# EAGLE design Trainii (EAGLE 9.1.1)
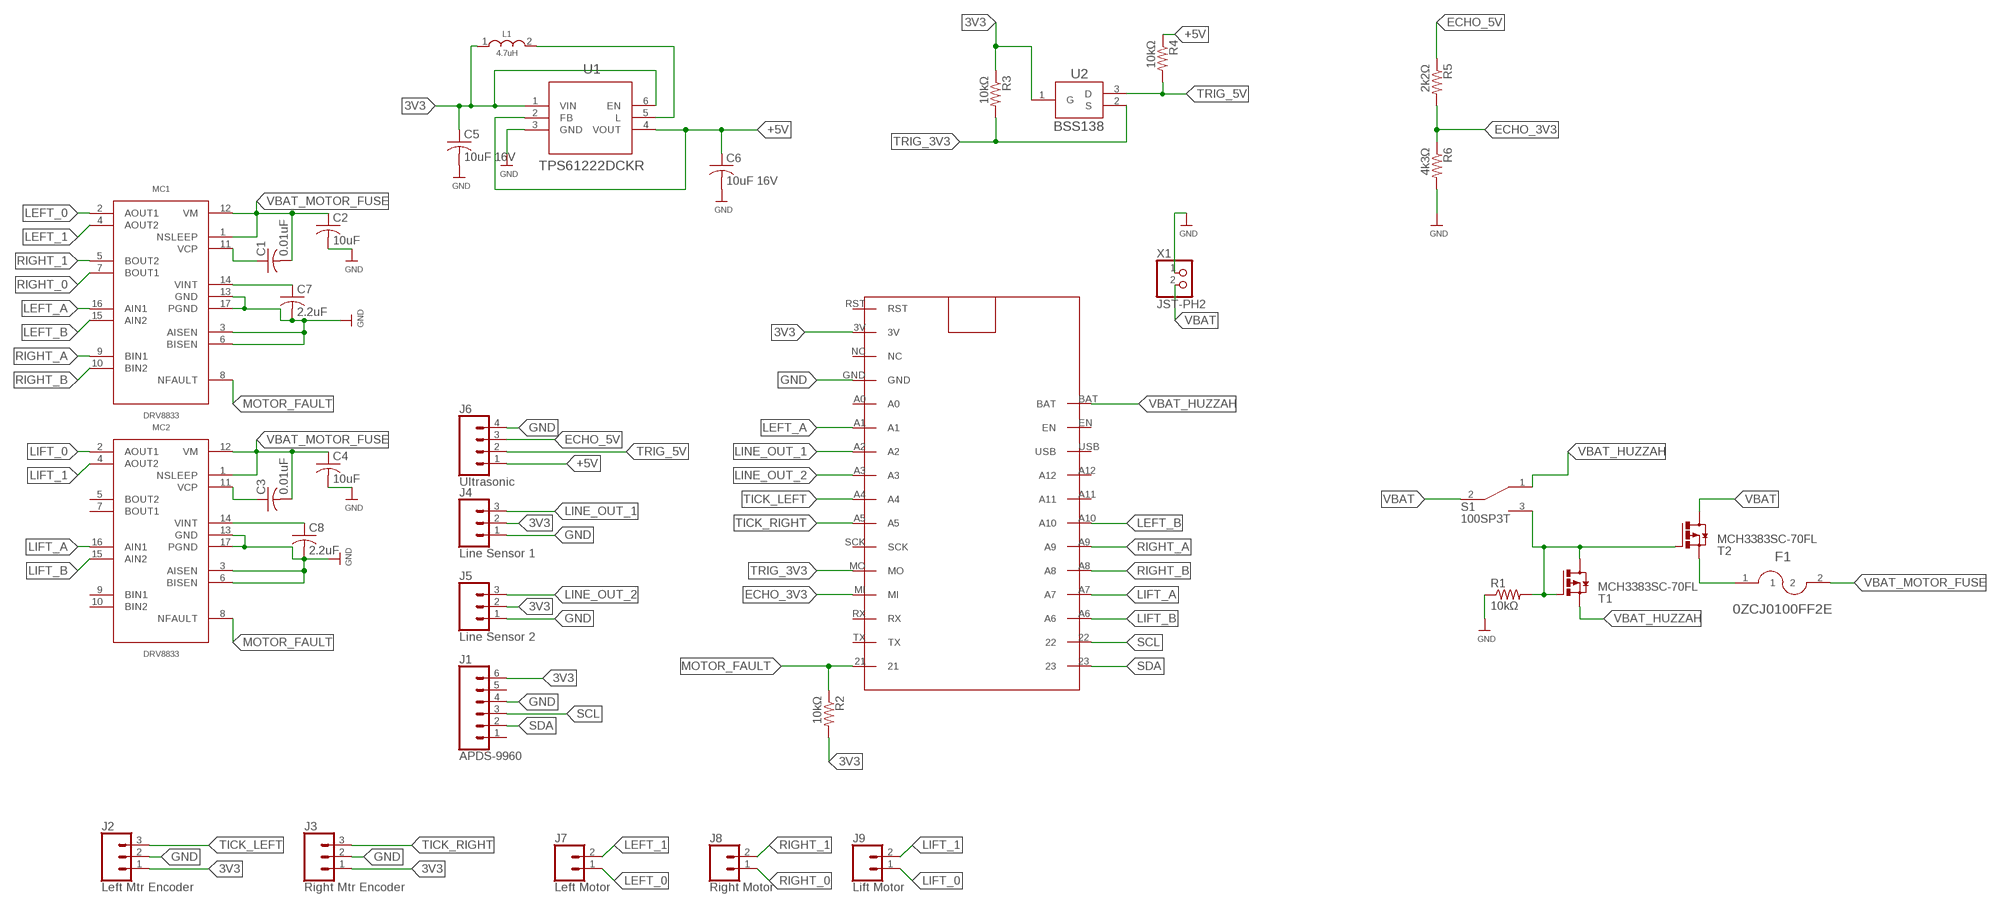
[diagram p0: schematic, sheet 1]

## Parts
C1  0.01uF  C-USC0805  [C0805]
C2  10uF  C-USC0805  [C0805]
C3  0.01uF  C-USC0805  [C0805]
C4  10uF  C-USC0805  [C0805]
C5  10uF 16V  C-USC0805  [C0805]
C6  10uF 16V  C-USC0805  [C0805]
C7  2.2uF  C-USC0805  [C0805]
C8  2.2uF  C-USC0805  [C0805]
F1  0ZCJ0100FF2E  [1206]
J1  APDS-9960  CONN_06SILK_FEMALE_PTH  [1X06]
J2  Left Mtr Encoder  CONN_03  [1X03]
J3  Right Mtr Encoder  CONN_03  [1X03]
J4  Line Sensor 1  CONN_03  [1X03]
J5  Line Sensor 2  CONN_03  [1X03]
J6  Ultrasonic  CONN_04  [1X04]
J7  Left Motor  CONN_02  [1X02]
J8  Right Motor  CONN_02  [1X02]
J9  Lift Motor  CONN_02  [1X02]
L1  4.7uH  VLS3012HBX  [VLS3012HBX]
M1  ESP32  [ESP32]
MC1  DRV8833  [HTSSOP-16]
MC2  DRV8833  [HTSSOP-16]
R1  10kΩ  R-US_R0805  [R0805]
R2  10kΩ  R-US_R0805  [R0805]
R3  10kΩ  R-US_R0805  [R0805]
R4  10kΩ  R-US_R0805  [R0805]
R5  2k2Ω  R-US_M0805  [M0805]
R6  4k3Ω  R-US_M0805  [M0805]
S1  100SP3T  [100SP3T]
T1  MCH3383SC-70FL  [SOTFL65P210X90-3]
T2  MCH3383SC-70FL  [SOTFL65P210X90-3]
U1  TPS61222DCKR  [DCK6]
U2  BSS138  [SOT-23-3L]
X1  JST-PH2  [JST-PH]

## Nets
3V3: C5.1 J1.6 J2.1 J3.1 J4.2 J5.2 L1.1(IN) M1.3V R2.2 R3.1 U1.1(VIN) U1.6(EN) U2.1(G)
+5V: C6.1 J6.1 R4.1 U1.2(FB) U1.4(VOUT)
ECHO_3V3: M1.MI R5.2 R6.1
ECHO_5V: J6.3 R5.1
GND: C2.2 C4.2 C5.2 C6.2 C7.2 C8.2 J1.4 J2.2 J3.2 J4.1 J5.1 J6.4 M1.GND MC1.3(AISEN) MC1.6(BISEN) MC1.13(GND) MC1.17(PGND) MC2.3(AISEN) MC2.6(BISEN) MC2.13(GND) MC2.17(PGND) R1.1 R6.2 U1.3(GND) X1.1
LEFT_0: J7.1 MC1.2(AOUT1)
LEFT_1: J7.2 MC1.4(AOUT2)
LEFT_A: M1.A1 MC1.16(AIN1)
LEFT_B: M1.A10 MC1.15(AIN2)
LIFT_0: J9.1 MC2.2(AOUT1)
LIFT_1: J9.2 MC2.4(AOUT2)
LIFT_A: M1.A7 MC2.16(AIN1)
LIFT_B: M1.A6 MC2.15(AIN2)
LINE_OUT_1: J4.3 M1.A2
LINE_OUT_2: J5.3 M1.A3
MOTOR_FAULT: M1.21 MC1.8(NFAULT) MC2.8(NFAULT) R2.1
N$1: L1.2(OUT) U1.5(L)
N$2: R1.2 S1.3(B) T1.1(G) T1.3(D) T2.1(G)
N$5: C8.1 MC2.14(VINT)
N$7: C1.1 MC1.11(VCP)
N$8: C7.1 MC1.14(VINT)
N$11: C3.1 MC2.11(VCP)
RIGHT_0: J8.1 MC1.7(BOUT1)
RIGHT_1: J8.2 MC1.5(BOUT2)
RIGHT_A: M1.A9 MC1.9(BIN1)
RIGHT_B: M1.A8 MC1.10(BIN2)
SCL: J1.3 M1.22
SDA: J1.2 M1.23
TICK_LEFT: J2.3 M1.A4
TICK_RIGHT: J3.3 M1.A5
TRIG_3V3: M1.MO R3.2 U2.2(S)
TRIG_5V: J6.2 R4.2 U2.3(D)
VBAT: S1.2(COMMON) T2.3(D) X1.2
VBAT_HUZZAH: M1.BAT S1.1(A) T1.2(S)
VBAT_MOTOR: F1.1 T2.2(S)
VBAT_MOTOR_FUSE: C1.2 C2.1 C3.2 C4.1 F1.2 MC1.1(NSLEEP) MC1.12(VM) MC2.1(NSLEEP) MC2.12(VM)
Unconnected: J1.1 J1.5 M1.A0 M1.A11 M1.A12 M1.EN M1.NC M1.RST M1.RX M1.SCK M1.TX M1.USB MC2.5(BOUT2) MC2.7(BOUT1) MC2.9(BIN1) MC2.10(BIN2)

## Library data of the parts
C1-C8 = rcl:C-US: CAPACITOR, American symbol; SPICEPREFIX: C
F1 = Trainii:0ZCJ0100FF2E
J1 = SparkFun-Connectors:CONN_06: Multi connection point. Often used as Generic Header-pin footprint for 0.1 inch spaced/style header connections On any of the 0.1 inch spaced packages, you can populate with these: Break Away Headers - Straight <https://www.sparkfun.com/products/116> (PRT-00116) Break Away Male Headers - Right Angle <https://www.sparkfun.com/products/553> (PRT-00553) Female Headers <https://www.sparkfun.com/products/115> (PRT-00115) Break Away Headers - Machine Pin <https://www.sparkfun.com/products/117> (PRT-00117) Break Away Female Headers - Swiss Machine Pin <https://www.sparkfun.com/products/743> (PRT-00743) Arduino Stackable Header - 6 Pin <https://www.sparkfun.com/products/9280> (PRT-09280) For SCREWTERMINALS and SPRING TERMINALS visit here: Screw Terimnals on SparkFun.com <https://www.sparkfun.com/search/results?term=Screw+Terminals> (5mm/3.5mm/2.54mm spacing) This device is also useful as a general connection point to wire up your design to another part of your project. Our various solder wires solder well into these plated through hole pads. Hook-Up Wire - Assortment (Stranded, 22 AWG) <https://www.sparkfun.com/products/11375> (PRT-11375) Hook-Up Wire - Assortment (Solid Core, 22 AWG) <https://www.sparkfun.com/products/11367> (PRT-11367) View the entire wire category on our website here <https://www.sparkfun.com/categories/141>; PROD_ID: CONN-08437
J2-J5 = SparkFun-Connectors:CONN_03: Multi connection point. Often used as Generic Header-pin footprint for 0.1 inch spaced/style header connections On any of the 0.1 inch spaced packages, you can populate with these: Break Away Headers - Straight <https://www.sparkfun.com/products/116> (PRT-00116) Break Away Male Headers - Right Angle <https://www.sparkfun.com/products/553> (PRT-00553) Female Headers <https://www.sparkfun.com/products/115> (PRT-00115) Break Away Headers - Machine Pin <https://www.sparkfun.com/products/117> (PRT-00117) Break Away Female Headers - Swiss Machine Pin <https://www.sparkfun.com/products/743> (PRT-00743) Stackable Header - 3 Pin (Female, 0.1") <https://www.sparkfun.com/products/13875> (PRT-13875) For SCREWTERMINALS and SPRING TERMINALS visit here: Screw Terimnals on SparkFun.com <https://www.sparkfun.com/search/results?term=Screw+Terminals> (5mm/3.5mm/2.54mm spacing) This device is also useful as a general connection point to wire up your design to another part of your project. Our various solder wires solder well into these plated through hole pads. Hook-Up Wire - Assortment (Stranded, 22 AWG) <https://www.sparkfun.com/products/11375> (PRT-11375) Hook-Up Wire - Assortment (Solid Core, 22 AWG) <https://www.sparkfun.com/products/11367> (PRT-11367) View the entire wire category on our website here <https://www.sparkfun.com/categories/141> Special notes: Molex polarized connector foot print use with SKU : PRT-08232 with associated crimp pins and housings.
J6 = SparkFun-Connectors:CONN_04: Multi connection point. Often used as Generic Header-pin footprint for 0.1 inch spaced/style header connections On any of the 0.1 inch spaced packages, you can populate with these: Break Away Headers - Straight <https://www.sparkfun.com/products/116> (PRT-00116) Break Away Male Headers - Right Angle <https://www.sparkfun.com/products/553> (PRT-00553) Female Headers <https://www.sparkfun.com/products/115> (PRT-00115) Break Away Headers - Machine Pin <https://www.sparkfun.com/products/117> (PRT-00117) Break Away Female Headers - Swiss Machine Pin <https://www.sparkfun.com/products/743> (PRT-00743) For SCREWTERMINALS and SPRING TERMINALS visit here: Screw Terimnals on SparkFun.com <https://www.sparkfun.com/search/results?term=Screw+Terminals> (5mm/3.5mm/2.54mm spacing) This device is also useful as a general connection point to wire up your design to another part of your project. Our various solder wires solder well into these plated through hole pads. Hook-Up Wire - Assortment (Stranded, 22 AWG) <https://www.sparkfun.com/products/11375> (PRT-11375) Hook-Up Wire - Assortment (Solid Core, 22 AWG) <https://www.sparkfun.com/products/11367> (PRT-11367) View the entire wire category on our website here <https://www.sparkfun.com/categories/141> Special notes: Molex polarized connector foot print use with SKU : PRT-08231 with associated crimp pins and housings. 1MM SMD Version SKU: PRT-10208; PROD_ID: CONN-09696
J7-J9 = SparkFun-Connectors:CONN_02: Multi connection point. Often used as Generic Header-pin footprint for 0.1 inch spaced/style header connections On any of the 0.1 inch spaced packages, you can populate with these: Break Away Headers - Straight <https://www.sparkfun.com/products/116> (PRT-00116) Break Away Male Headers - Right Angle <https://www.sparkfun.com/products/553> (PRT-00553) Female Headers <https://www.sparkfun.com/products/115> (PRT-00115) Break Away Headers - Machine Pin <https://www.sparkfun.com/products/117> (PRT-00117) Break Away Female Headers - Swiss Machine Pin <https://www.sparkfun.com/products/743> (PRT-00743) For SCREWTERMINALS and SPRING TERMINALS visit here: Screw Terimnals on SparkFun.com <https://www.sparkfun.com/search/results?term=Screw+Terminals> (5mm/3.5mm/2.54mm spacing) This device is also useful as a general connection point to wire up your design to another part of your project. Our various solder wires solder well into these plated through hole pads. Hook-Up Wire - Assortment (Stranded, 22 AWG) <https://www.sparkfun.com/products/11375> (PRT-11375) Hook-Up Wire - Assortment (Solid Core, 22 AWG) <https://www.sparkfun.com/products/11367> (PRT-11367) View the entire wire category on our website here <https://www.sparkfun.com/categories/141> Special notes: Molex polarized connector foot print use with: PRT-08233 with associated crimp pins and housings. 2.54_SCREWTERM for use with PRT-10571. 3.5mm Screw Terminal footprints for PRT-08084 5mm Screw Terminal footprints for use with PRT-08432
L1 = Trainii:VLS3012HBX
M1 = Trainii:ESP32
MC1 MC2 = Trainii:DRV8833
R1-R6 = rcl:R-US_: RESISTOR, American symbol; SPICEPREFIX: R
S1 = Trainii:100SP3T
T1 T2 = Trainii:MCH3383
U1 = Trainii:TPS61222DCKR; MANUFACTURER_PART_NUMBER: TPS61222DCKR; VENDOR: Texas Instruments
U2 = Trainii:BSS138; MANUFACTURER_PART_NUMBER: BSS138; VENDOR: Fairchild Semiconductor
X1 = Trainii:JST-PH2

## Board
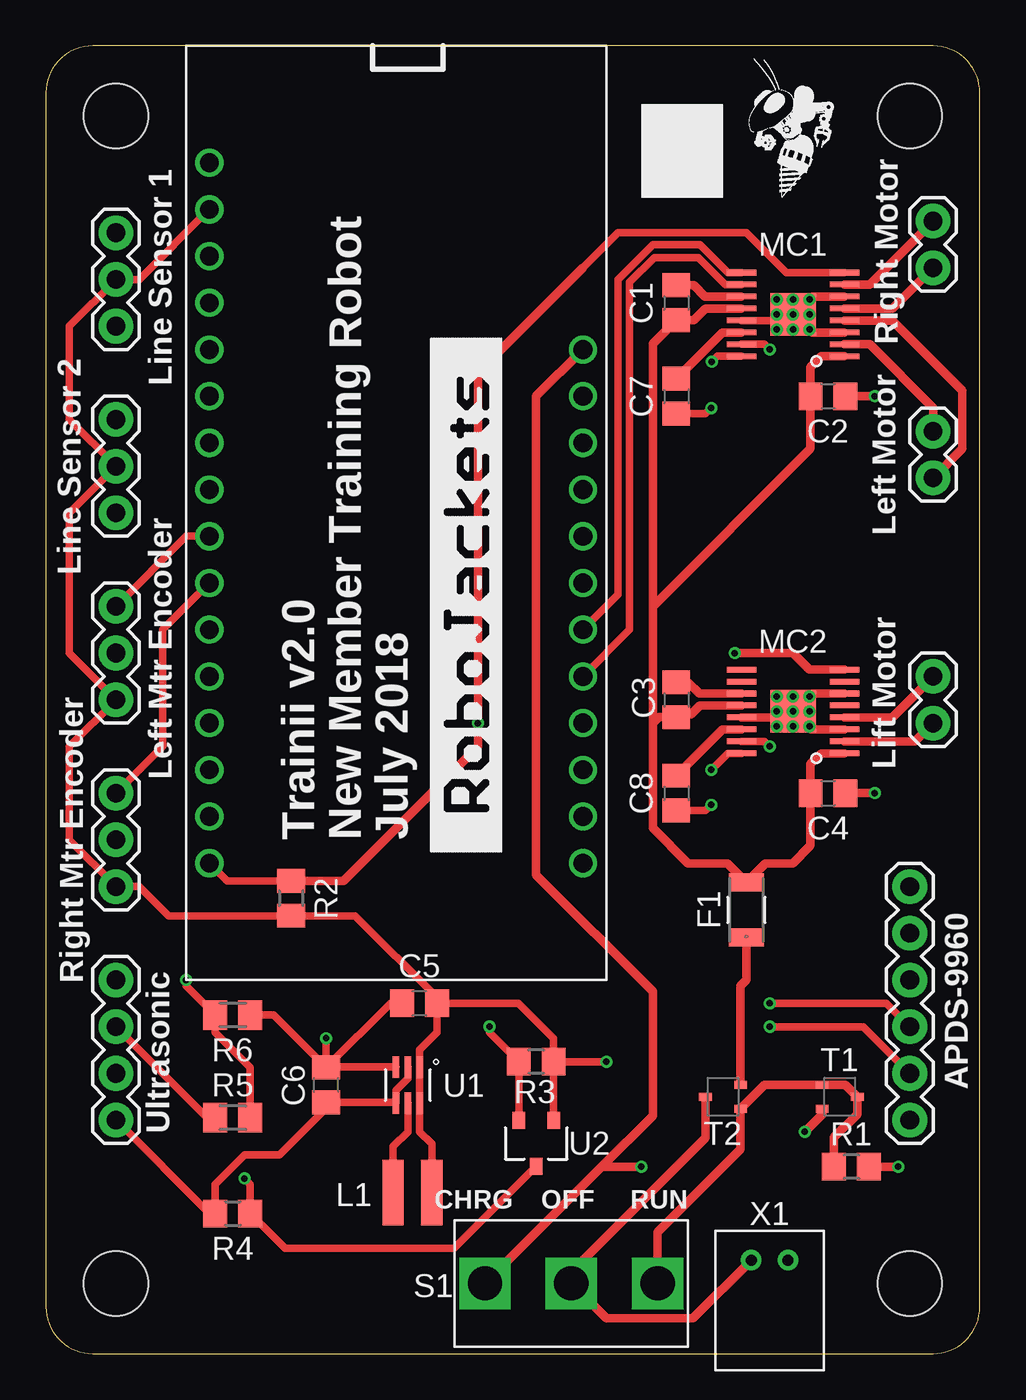
[diagram p1: board, top side]
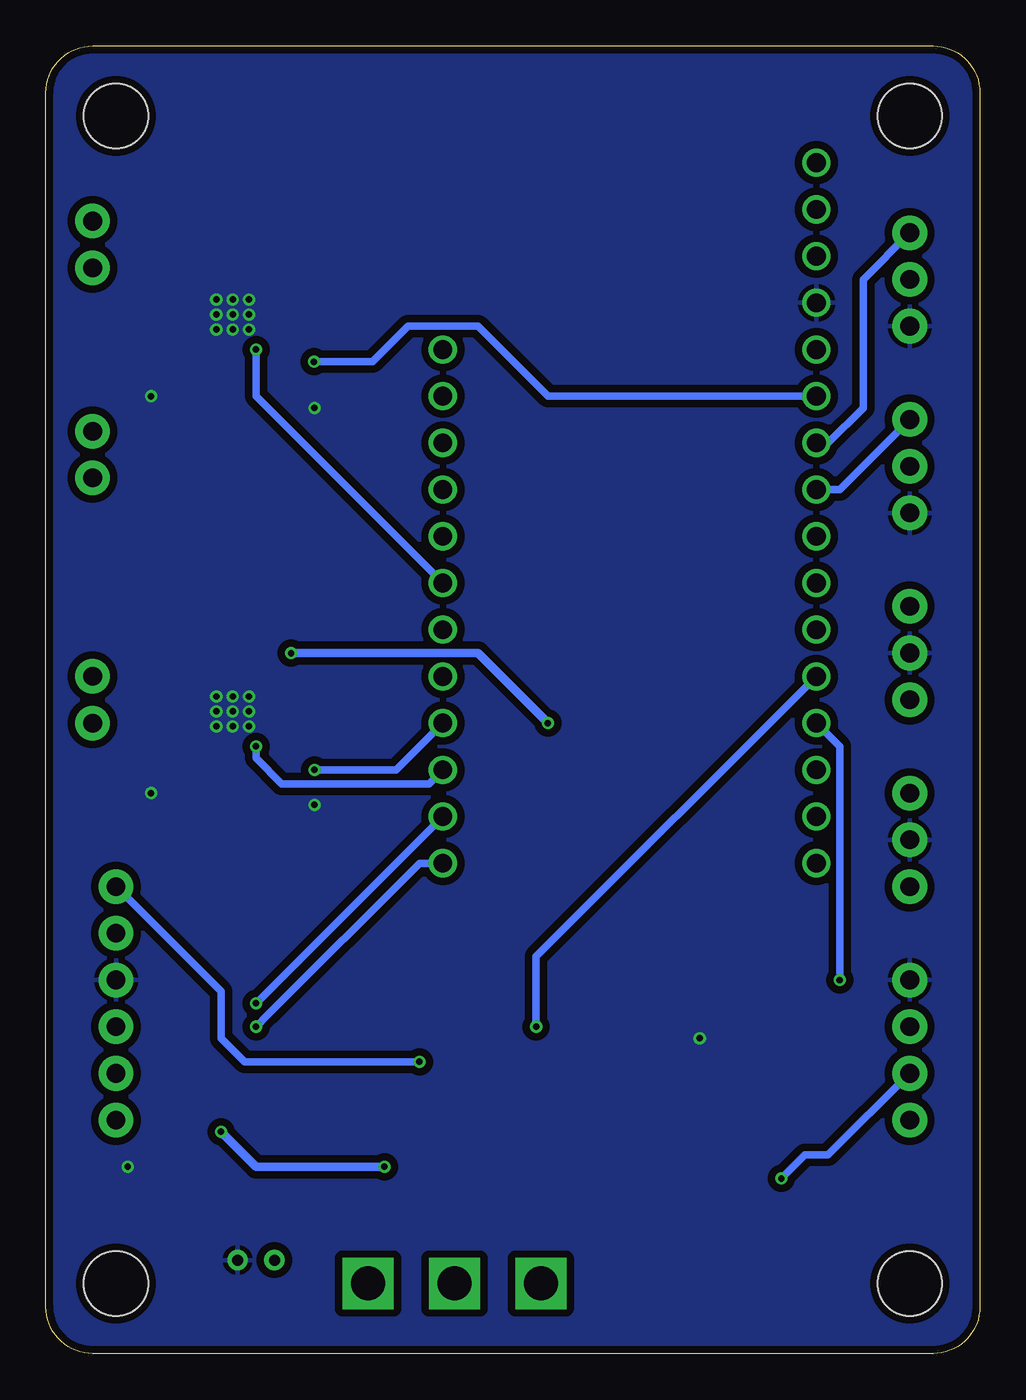
[diagram p2: board, bottom side, seen from below]

Size 50.8 x 71.12 mm. Coordinates in mm from the lower left corner, seen from the top.
Outline: 48.26,71.12 2.54,71.12 arc90 0,68.58 0,2.54 arc90 2.54,0 48.26,0 arc90 50.8,2.54 50.8,68.58 arc90 48.26,71.12
Copper layers (1*16): Top 0.035mm / dielectric 1.5mm / Bottom 0.035mm
Design rules "SeeedStudio": minimum track width 6mil, minimum drill 12mil, track to track 6mil, track to pad 6mil, pad to pad 6mil, via to via 6mil, smd to smd 0mil, copper to edge 10mil, drill to drill 10mil, minimum pad ring 10mil, minimum via ring 6mil, stop-mask expansion 2mil, vias tented up to drill 100mil, thermal gap 10mil
Holes 3.51 mm at 3.81,67.31 46.99,67.31 3.81,3.81 46.99,3.81

### Footprints (pad centres in the part's own frame; a part is rotated, then mirrored left to right if it is on the bottom)
C0805 = smd 1.3 x 1.5: 1 -0.95,0; 2 0.95,0
1206 = smd 0.991 x 1.905: 1 -1.499,0; 2 1.499,0
1X06 = drill 1.016 pad 1.88: 1 0,0; 2 2.54,0; 3 5.08,0; 4 7.62,0; 5 10.16,0; 6 12.7,0
1X03 = drill 1.016 pad 1.88: 1 0,0; 2 2.54,0; 3 5.08,0
1X04 = drill 1.016 pad 1.88: 1 0,0; 2 2.54,0; 3 5.08,0; 4 7.62,0
1X02 = drill 1.016 pad 1.88: 1 0,0; 2 2.54,0
VLS3012HBX = smd 1.143 x 3.556: 1 -1.05,0; 2 1.05,0
ESP32 = drill 1.02: 3V -10.16,16.51; 21 -10.16,-19.05; 22 10.16,-16.51; 23 10.16,-19.05; A0 -10.16,8.89; A1 -10.16,6.35; A2 -10.16,3.81; A3 -10.16,1.27; A4 -10.16,-1.27; A5 -10.16,-3.81; A6 10.16,-13.97; A7 10.16,-11.43; A8 10.16,-8.89; A9 10.16,-6.35; A10 10.16,-3.81; A11 10.16,-1.27; A12 10.16,1.27; BAT 10.16,8.89; EN 10.16,6.35; GND -10.16,11.43; MI -10.16,-11.43; MO -10.16,-8.89; NC -10.16,13.97; RST -10.16,19.05; RX -10.16,-13.97; SCK -10.16,-6.35; TX -10.16,-16.51; USB 10.16,3.81
HTSSOP-16 = smd 1.6 x 0.3: 1 -2.8,2.275; 2 -2.8,1.625; 3 -2.8,0.975; 4 -2.8,0.325; 5 -2.8,-0.325; 6 -2.8,-0.975; 7 -2.8,-1.625; 8 -2.8,-2.275; 9 2.8,-2.275; 10 2.8,-1.625; 11 2.8,-0.975; 12 2.8,-0.325; 13 2.8,0.325; 14 2.8,0.975; 15 2.8,1.625; 16 2.8,2.275 | smd 2.46 x 2.31: 17 0,0
R0805 = smd 1.3 x 1.5: 1 -0.95,0; 2 0.95,0
M0805 = smd 1.3 x 1.6: 1 -0.95,0; 2 0.95,0
100SP3T = drill 1.854 square: 1 -4.699,0; 2 0,0; 3 4.699,0
SOTFL65P210X90-3 = smd 0.685 x 0.437: 1 -0.958,0.65; 2 -0.958,-0.65; 3 0.958,0
DCK6 = smd 1.168 x 0.356: 1 -0.978,0.65; 2 -0.978,0; 3 -0.978,-0.65; 4 0.978,-0.65; 5 0.978,0; 6 0.978,0.65
SOT-23-3L = smd 0.66 x 0.914: 1 -0.95,-1.245; 2 0.95,-1.245; 3 0,1.245
JST-PH = drill 0.6: 1 -1,0; 2 1,0

### Placement (x,y rotation side)
C1  34.29,57.15 270 top
C2  42.55,52.07 0 top
C3  34.29,35.56 270 top
C4  42.55,30.48 0 top
C5  20.32,19.05 180 top
C6  15.24,14.61 90 top
C7  34.29,52.07 270 top
C8  34.29,30.48 270 top
F1  38.1,24.13 90 top
J1  46.99,12.7 90 top
J2  3.81,35.56 90 top
J3  3.81,25.4 90 top
J4  3.81,55.88 90 top
J5  3.81,45.72 90 top
J6  3.81,12.7 90 top
J7  48.26,50.16 270 top
J8  48.26,61.59 270 top
J9  48.26,34.29 90 top
L1  19.94,8.76 180 top
M1  19.05,45.72 0 top
MC1  40.64,56.52 180 top
MC2  40.64,34.92 180 top
R1  43.81,10.16 180 top
R2  13.34,24.77 270 top
R3  26.67,15.88 180 top
R4  10.16,7.62 0 top
R5  10.16,12.83 0 top
R6  10.16,18.41 0 top
S1  28.57,3.81 0 top
T1  43.18,13.97 0 top
T2  36.83,13.97 180 top
U1  19.68,14.61 270 top
U2  26.67,11.43 180 top
U$2  [ROBOJACKETS]  24.77,27.3 90 top
U$6  [ROBOBUZZ_0.4X]  40.01,62.87 0 top
X1  39.37,5.08 180 top

### Tracks (layer width: path | path; a pad name or v marks a point on that pad's centre or on a via)
3V3  (via drill 0.35)
  Top 0.406: C5.1 21.27,19.37 16.82,23.82 R2.2 6.67,23.82 5.08,25.4 J3.1 1.27,27.94 1.27,33.02 J2.1 1.27,38.1 1.27,45.09 1.27,45.72 J5.2 1.27,50.8 1.27,55.88 J4.2 5.08,58.42 M1.3V | C5.1 25.72,19.05 27.62,17.15 R3.1 | C5.1 21.27,17.46 20.34,16.52 U1.1 U1.6 20.32,13.61 20.32,12.06 20.99,11.4 L1.1 | R3.1 U2.1 | R3.1 v30.48,15.88
  Bottom 0.406: J1.6 41.27,19.68 41.27,17.14 40.01,15.88 v30.48,15.88
+5V
  Top 0.406: J6.1 8.89,7.62 R4.1 9.21,9.21 10.79,10.79 12.7,10.79 15.24,13.34 C6.1 19.01,13.65 U1.4 19.04,14.32 19.68,14.97 U1.2
ECHO_3V3  (via drill 0.35)
  Top 0.406: R5.2 11.11,15.56 9.21,17.46 R6.1 7.62,20 v7.62,20.32
  Bottom 0.406: M1.MI 7.62,33.02 v7.62,20.32
ECHO_5V
  Top 0.406: J6.3 8.76,12.83 R5.1
GND  (via drill 0.35)
  Top 0.305: 40.01,34.11 v40.64,34.11
  Top 0.406: C6.2 12.38,18.41 R6.2 | C6.2 18.73,19.05 C5.2 | U1.3 15.27,15.58 C6.2 | C6.2 v15.24,17.14 | C8.2 35.88,29.53 v36.2,29.84 | C7.2 35.88,51.12 v36.2,51.44 | v40.64,34.11 MC2.17 41.27,34.29 | MC1.13 40.31,56.19
  Top 0.457: MC1.3 41.69,55.54 v41.53,55.7 | MC1.6 41.69,57.49 v41.53,57.33 | 40.31,56.19 MC1.17 | MC2.13 39.52,34.6 40.01,34.11 | MC2.6 41.69,35.9 v41.53,35.74 | C2.2 v45.09,52.07 | C4.2 v45.09,30.48 | R1.1 v46.35,10.16 | MC2.3 41.62,33.95 41.27,34.29
  other vias: 41.53,56.52 40.64,57.33 39.75,56.52 40.64,56.52 39.75,55.7 40.64,55.7 39.75,57.33 39.75,35.74 40.64,35.74 41.53,34.92 40.64,34.92 39.75,34.92 39.75,34.11 41.53,34.11
  pour Bottom (isolate 0.406): 0,2.54 0,68.58 arc-90 2.54,71.12 48.26,71.12 arc-90 50.8,68.58 50.8,2.54 arc-90 48.26,0 2.54,0 arc-90
LEFT_0
  Top 0.457: MC1.2 44.8,54.89 48.26,51.44 J7.1
LEFT_1
  Top 0.457: MC1.4 44.45,56.19 46.05,56.19 49.53,52.7 49.85,52.39 49.85,49.21 J7.2
LEFT_A  (via drill 0.35)
  Top 0.406: MC1.16 36.51,54.24 v36.22,53.95
  Bottom 0.406: v36.22,53.95 33.05,53.95 31.11,55.88 27.3,55.88 23.5,52.07 M1.A1
LEFT_B  (via drill 0.35)
  Top 0.406: MC1.15 39.09,54.89 v39.37,54.61
  Bottom 0.406: v39.37,54.61 39.37,52.07 M1.A10
LIFT_0
  Top 0.457: MC2.2 47.27,33.3 J9.1
LIFT_1
  Top 0.457: MC2.4 46.03,34.6 J9.2
LIFT_A  (via drill 0.35)
  Top 0.406: MC2.16 37.09,32.65 v36.2,31.75
  Bottom 0.406: M1.A7 31.75,31.75 v36.2,31.75
LIFT_B  (via drill 0.35)
  Top 0.406: MC2.15 39.09,33.3 v39.37,33.02
  Bottom 0.406: v39.37,33.02 39.37,32.38 37.97,30.99 29.97,30.99 M1.A6
LINE_OUT_1
  Bottom 0.406: J4.3 6.35,58.42 6.35,51.44 8.26,49.53 M1.A2
LINE_OUT_2
  Bottom 0.406: J5.3 7.62,46.99 M1.A3
MOTOR_FAULT  (via drill 0.35)
  Top 0.406: R2.1 9.85,25.71 M1.21 | MC1.8 40.27,58.79 38.1,60.96 31.75,60.96 31.11,60.96 29.21,59.05
  Top 0.457: 29.21,59.05 28.89,58.74 23.5,53.34 23.5,37.47 v23.5,34.29 23.5,33.02 16.19,25.71 R2.1 | MC2.8 41.54,37.2 40.64,38.1 v37.47,38.1
  Bottom 0.457: v37.47,38.1 27.3,38.1 v23.5,34.29
N$1
  Top 0.406: U1.5 19.68,12.06 18.89,11.27 L1.2
N$2
  Top 0.457: R1.2 42.87,11.75 44.14,13.02 T1.3 43.49,14.62 T1.1 39.09,14.62 T2.1 37.79,11.12 33.27,6.6 S1.3
N$5
  Top 0.457: C8.1 36.81,33.95 MC2.14
N$7
  Top 0.457: C1.1 35.24,58.1 35.85,57.49 MC1.11
N$8
  Top 0.457: C7.1 36.81,55.54 MC1.14
N$11
  Top 0.457: C3.1 34.92,36.51 35.53,35.9 MC2.11
RIGHT_0
  Top 0.457: MC1.7 44.8,58.14 J8.1
RIGHT_1
  Top 0.457: J8.2 46.05,56.84 MC1.5
RIGHT_A
  Top 0.406: MC1.9 37.09,58.79 35.56,60.33 33.02,60.33 31.11,58.42 31.11,41.27 M1.A9
RIGHT_B
  Top 0.406: M1.A8 31.75,39.37 31.75,58.27 33.1,59.61 35.48,59.61 36.95,58.14 MC1.10
SCL  (via drill 0.35)
  Top 0.406: J1.3 45.72,19.05 v39.37,19.05
  Bottom 0.406: M1.22 v39.37,19.05
SDA  (via drill 0.35)
  Top 0.406: J1.2 45.09,17.14 44.45,17.78 v39.37,17.78
  Bottom 0.406: M1.23 30.48,26.67 38.73,18.41 v39.37,17.78
TICK_LEFT
  Top 0.406: J2.3 7.62,44.45 M1.A4
TICK_RIGHT
  Top 0.406: J3.3 6.35,33.02 6.35,39.37 M1.A5
TRIG_3V3  (via drill 0.35)
  Top 0.406: U2.2 R3.2 24.13,17.46 | 24.13,17.46 v24.13,17.78 24.13,17.46
  Bottom 0.406: v24.13,17.78 24.13,21.59 M1.MO
TRIG_5V  (via drill 0.35)
  Top 0.406: U2.3 22.2,5.71 13.02,5.71 R4.2 11.11,9.21 v10.79,9.53
  Bottom 0.406: v10.79,9.53 9.53,10.79 8.26,10.79 J6.2
VBAT
  Top 0.457: T2.3 35.87,12.7 35.87,11.74 33.02,8.89 28.57,4.45 S1.2 30.48,1.91 35.2,1.91 X1.2
VBAT_HUZZAH  (via drill 0.35)
  Top 0.457: M1.BAT 26.67,52.07 26.67,26.04 33.01,19.7 33.01,12.94 30.23,10.16 | S1.1 30.23,10.16 | 30.23,10.16 v32.38,10.16 | v41.27,12.06 42.22,13.01 T1.2
  Bottom 0.457: v41.27,12.06 39.37,10.16 v32.38,10.16
VBAT_MOTOR
  Top 0.457: F1.1 38.1,20.32 37.79,20.01 T2.2
VBAT_MOTOR_FUSE
  Top 0.406: 33.02,54.61 33.02,40.64 33.02,34.29
  Top 0.457: MC2.12 35.56,35.25 35.08,34.77 34.45,34.77 C3.2 33.34,34.61 33.02,34.29 | MC1.12 35.88,56.84 35.24,56.2 C1.2 33.02,54.93 33.02,54.61 33.02,34.29 | MC2.1 42.17,32.65 41.59,32.07 C4.1 41.59,27.62 40.64,26.67 39.14,26.67 F1.2 37.06,26.67 34.92,26.67 33.02,28.57 33.02,34.29 | MC1.1 42.17,54.24 41.59,53.66 C2.1 41.59,49.22 33.02,40.64

### Text on the board
tPlace: Trainii v2.0 | New Member Training Robot | July 2018 | CHRG | OFF | RUN